# EAGLE schematic optronik (EAGLE 7.5.0)

## Sheet 1 of 4: MAIN
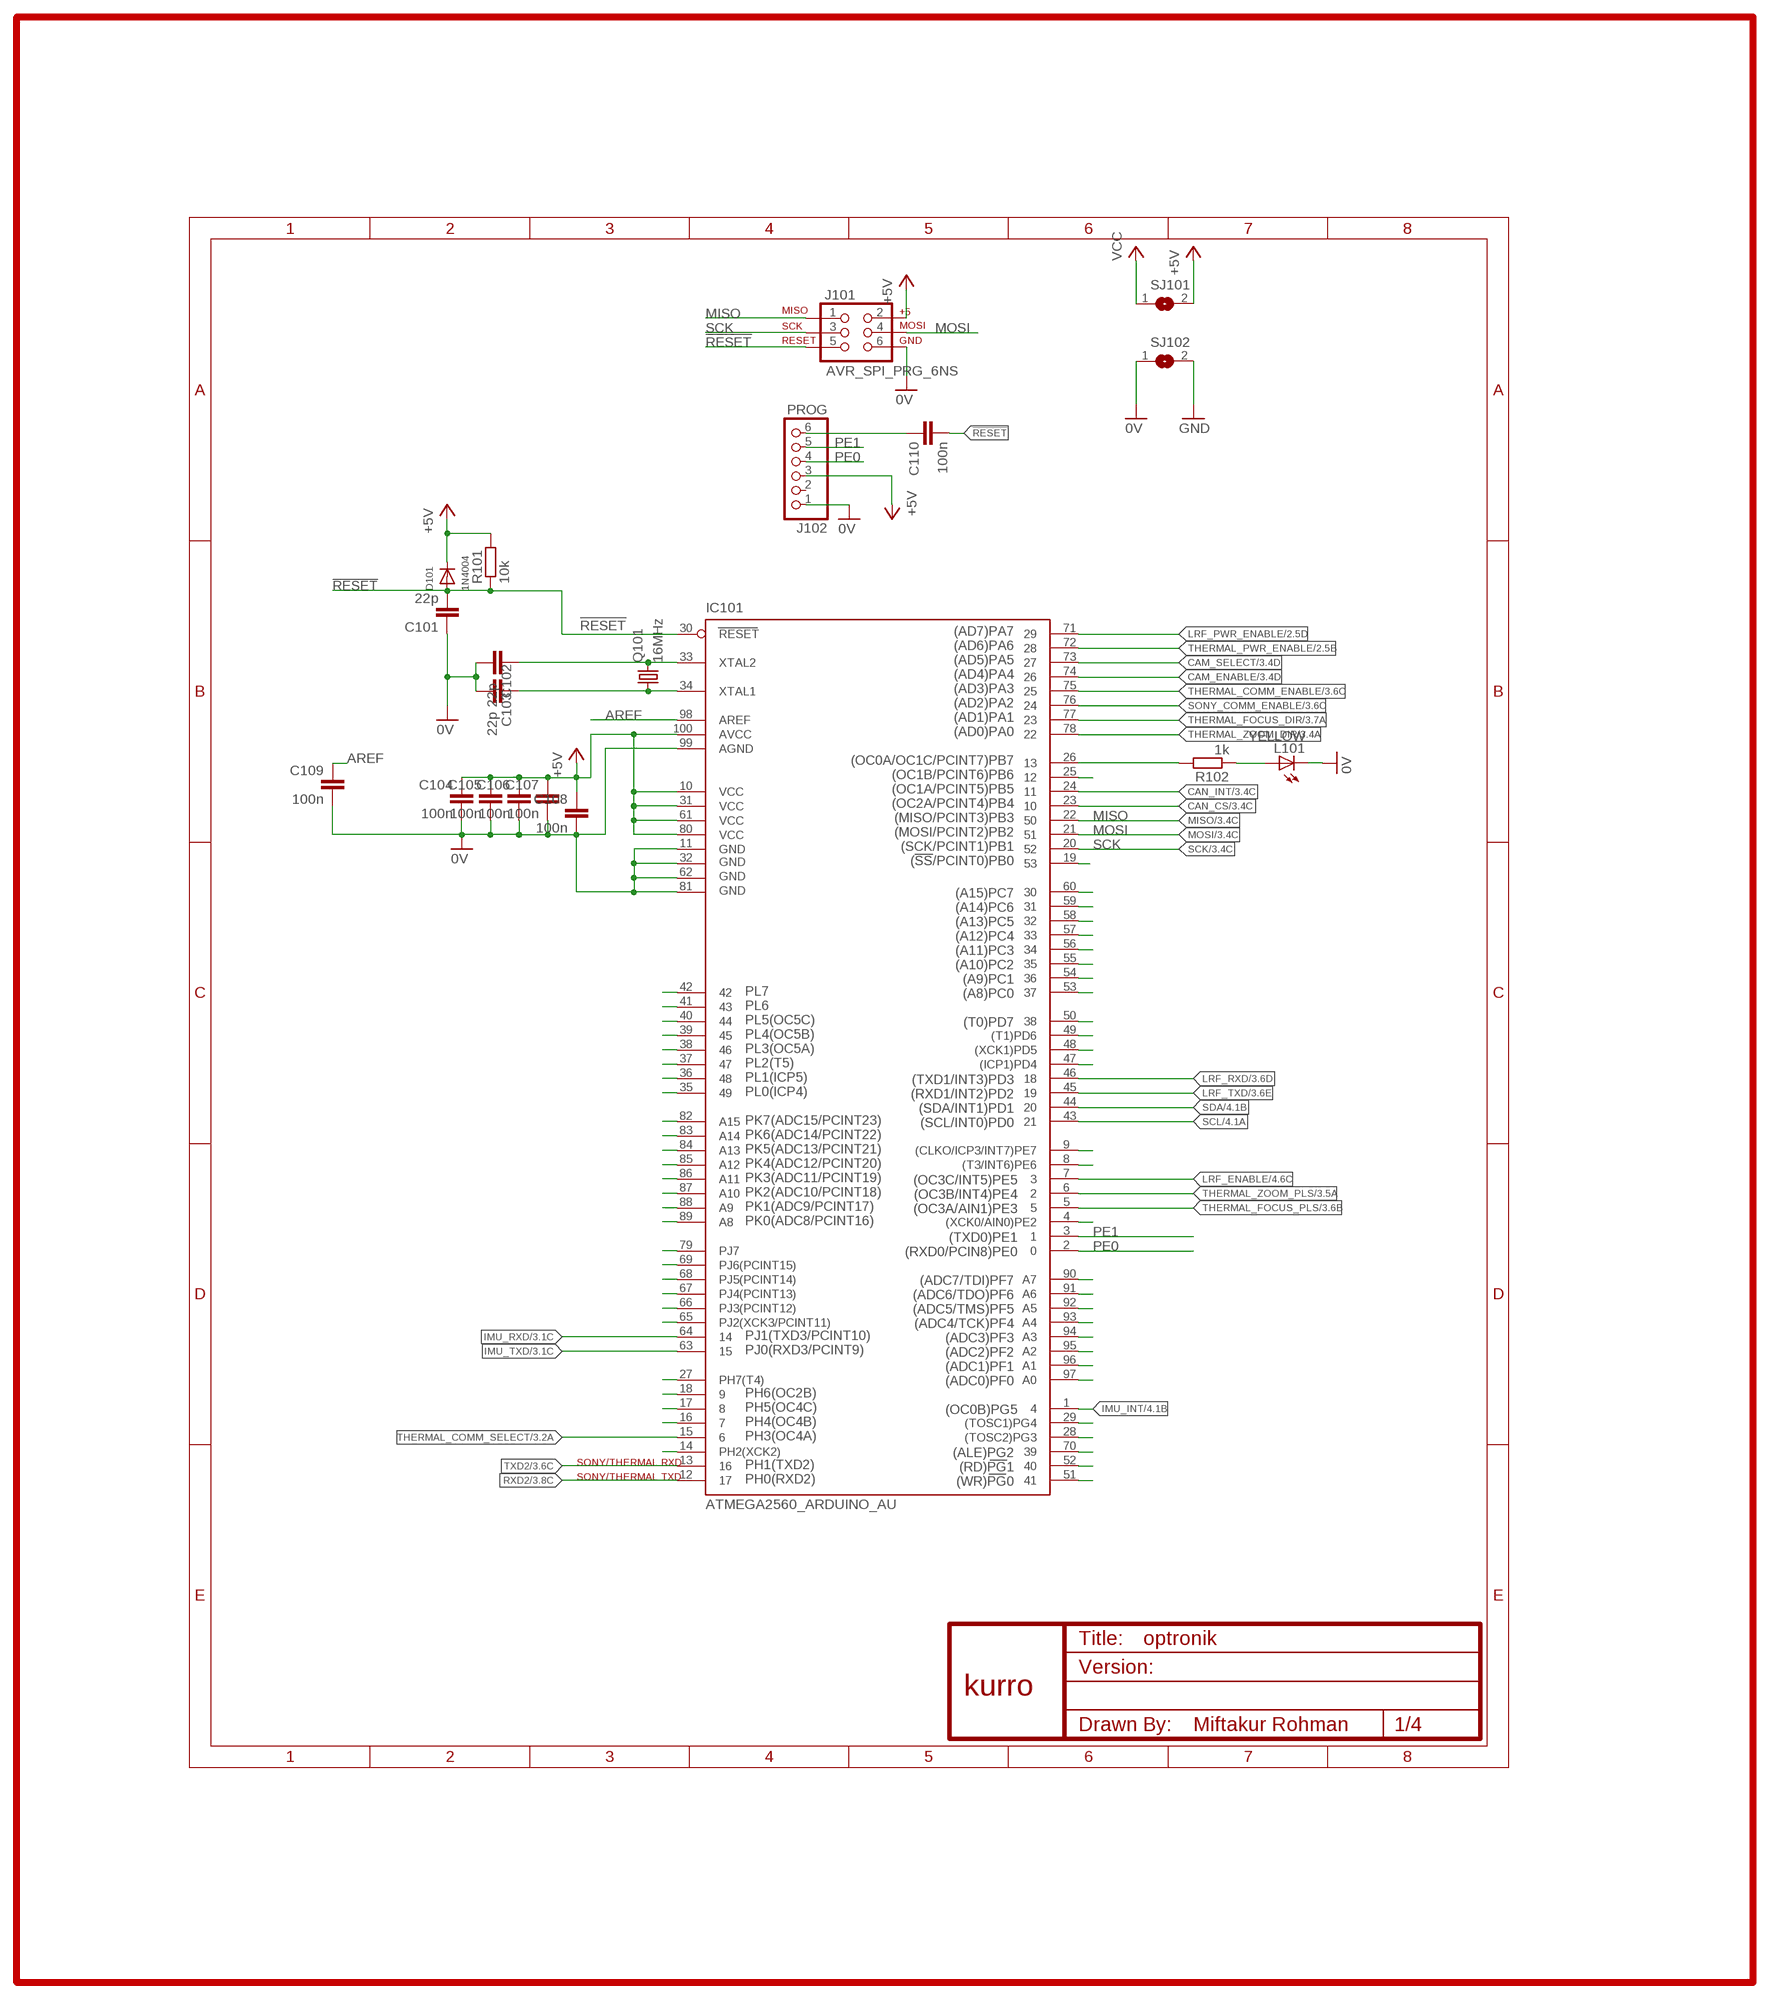
[diagram p0: schematic, sheet 1]

### Parts
C101  22p  C-EUC0603  [C0603]
C102  22p  C-EUC0603  [C0603]
C103  22p  C-EUC0603  [C0603]
C104  100n  C-EUC0603  [C0603]
C105  100n  C-EUC0603  [C0603]
C106  100n  C-EUC0603  [C0603]
C107  100n  C-EUC0603  [C0603]
C108  100n  C-EUC0603  [C0603]
C109  100n  C-EUC0603  [C0603]
C110  100n  C-EUC0603  [C0603]
D101  1N4004  DIODESOD-323F  [SOD-323F]
IC101  ATMEGA2560_ARDUINO_AU  [TQFP-100-14X14MM]
J101  AVR_SPI_PRG_6NS  [2X3-NS]
J102  PROG  PINHD-1X6  [1X06]
L101  YELLOW  LED5MM  [LED5MM]
Q101  16MHz  CRYSTAL-TXC-7A2  [CRYSTAL-TXC-7A2]
R101  10k  R-EU_R0603  [R0603]
R102  1k  R-EU_R0603  [R0603]
SJ101  SJS  [SJS]
SJ102  SJS  [SJS]
U$1  KURRO_FOOTPRINT  [KURRO-LOGO]

### Nets
0V [ic]: C101.1 C102.1 C103.1 C104.2 C105.2 C106.2 C107.2 C108.2 C109.2 IC101.11(GND) IC101.32(GND1) IC101.62(GND2) IC101.81(GND3) IC101.99(AGND) J101.6 J102.1 L101.K(C) SJ102.1
!RESET [ic]: C101.2 C110.2 D101.A IC101.30(RESET) J101.5 R101.1
+5V [ic]: C104.1 C105.1 C106.1 C107.1 C108.1 D101.C IC101.10(VCC) IC101.31(VCC1) IC101.61(VCC2) IC101.80(VCC3) IC101.100(AVCC) J101.2 J102.3 R101.2 SJ101.2
AREF [ic]: C109.1 IC101.98(AREF)
CAM_ENABLE: IC101.74 ; also sheet 3
CAM_SELECT [ic]: IC101.73 ; also sheet 3
CAN_CS: IC101.23 ; also sheet 3
CAN_INT [ic]: IC101.24 ; also sheet 3
GND: SJ102.2 ; also sheet 2,3,4
IMU_INT [ic]: IC101.1 ; also sheet 4
IMU_RXD [ic]: IC101.64 ; also sheet 3
IMU_TXD [ic]: IC101.63 ; also sheet 3
LRF_ENABLE [ic]: IC101.7 ; also sheet 4
LRF_PWR_ENABLE [ic]: IC101.71 ; also sheet 2
LRF_RXD [ic]: IC101.46 ; also sheet 3,4
LRF_TXD [ic]: IC101.45 ; also sheet 3,4
MISO [ic]: IC101.22 J101.1 ; also sheet 3
MOSI [ic]: IC101.21 J101.4 ; also sheet 3
N$1 [ic]: IC101.26 R102.2
N$10 [ic]: IC101.14(PH2(XCK2))
N$13 [ic]: L101.A R102.1
N$15 [ic]: IC101.16
N$17 [ic]: IC101.17
N$18 [ic]: IC101.18
N$19 [ic]: IC101.27(PH7(T4))
N$20 [ic]: IC101.65(PJ2(XCK3/PCINT11))
N$21 [ic]: IC101.66(PJ3(PCINT12))
N$22 [ic]: IC101.67(PJ4(PCINT13))
N$24 [ic]: IC101.68(PJ5(PCINT14))
N$25 [ic]: IC101.69(PJ6(PCINT15))
N$26 [ic]: IC101.79(PJ7)
N$27 [ic]: IC101.89(A8)
N$28 [ic]: IC101.88(A9)
N$29 [ic]: IC101.87(A10)
N$30 [ic]: IC101.86(A11)
N$31 [ic]: IC101.85(A12)
N$32 [ic]: IC101.84(A13)
N$33 [ic]: IC101.83(A14)
N$34 [ic]: IC101.82(A15)
N$35 [ic]: IC101.35
N$36 [ic]: IC101.36
N$37 [ic]: IC101.37
N$38 [ic]: IC101.38
N$39 [ic]: IC101.39
N$40 [ic]: IC101.40
N$41 [ic]: IC101.41
N$42 [ic]: IC101.42
N$49 [ic]: IC101.60
N$50 [ic]: IC101.59
N$51 [ic]: IC101.58
N$52 [ic]: IC101.57
N$53: C110.1 J102.6
N$54 [ic]: IC101.56
N$55 [ic]: IC101.55
N$56 [ic]: IC101.54
N$57 [ic]: IC101.53
N$58 [ic]: IC101.50
N$59 [ic]: IC101.49((T1)PD6)
N$60 [ic]: IC101.48((XCK1)PD5)
N$61 [ic]: IC101.47((ICP1)PD4)
N$63 [ic]: IC101.25
N$64 [ic]: IC101.9((CLKO/ICP3/INT7)PE7)
N$65 [ic]: IC101.8((T3/INT6)PE6)
N$66 [ic]: IC101.4((XCK0/AIN0)PE2)
N$67 [ic]: IC101.90(A7)
N$68 [ic]: IC101.91(A6)
N$69 [ic]: IC101.92(A5)
N$70 [ic]: IC101.93(A4)
N$71 [ic]: IC101.94(A3)
N$72 [ic]: IC101.95(A2)
N$73 [ic]: IC101.96(A1)
N$74 [ic]: IC101.97(A0)
N$76 [ic]: IC101.29((TOSC1)PG4)
N$77 [ic]: IC101.28((TOSC2)PG3)
N$78 [ic]: IC101.70
N$79 [ic]: IC101.52
N$80 [ic]: IC101.51
N$84 [ic]: IC101.19
PE0 [ic]: IC101.2 J102.4
PE1 [ic]: IC101.3 J102.5
RXD2 [ic]: IC101.12 ; also sheet 3
SCK [ic]: IC101.20 J101.3 ; also sheet 3
SCL [ic]: IC101.43 ; also sheet 4
SDA [ic]: IC101.44 ; also sheet 4
SONY_COMM_ENABLE [ic]: IC101.76 ; also sheet 3
THERMAL_COMM_ENABLE [ic]: IC101.75 ; also sheet 3
THERMAL_COMM_SELECT [ic]: IC101.15 ; also sheet 3
THERMAL_FOCUS_DIR [ic]: IC101.77 ; also sheet 3
THERMAL_FOCUS_PLS [ic]: IC101.5 ; also sheet 3
THERMAL_PWR_ENABLE [ic]: IC101.72 ; also sheet 2
THERMAL_ZOOM_DIR [ic]: IC101.78 ; also sheet 3
THERMAL_ZOOM_PLS [ic]: IC101.6 ; also sheet 3
TXD2 [ic]: IC101.13 ; also sheet 3
VCC: SJ101.1 ; also sheet 2,3,4
XTAL1 [ic]: C103.2 IC101.34(XTAL1) Q101.P$1
XTAL2 [ic]: C102.2 IC101.33(XTAL2) Q101.P$2
Unconnected: J102.2

### Notes on the sheet
- SONY/THERMAL RXD
- SONY/THERMAL TXD

## Sheet 2 of 4: PSU
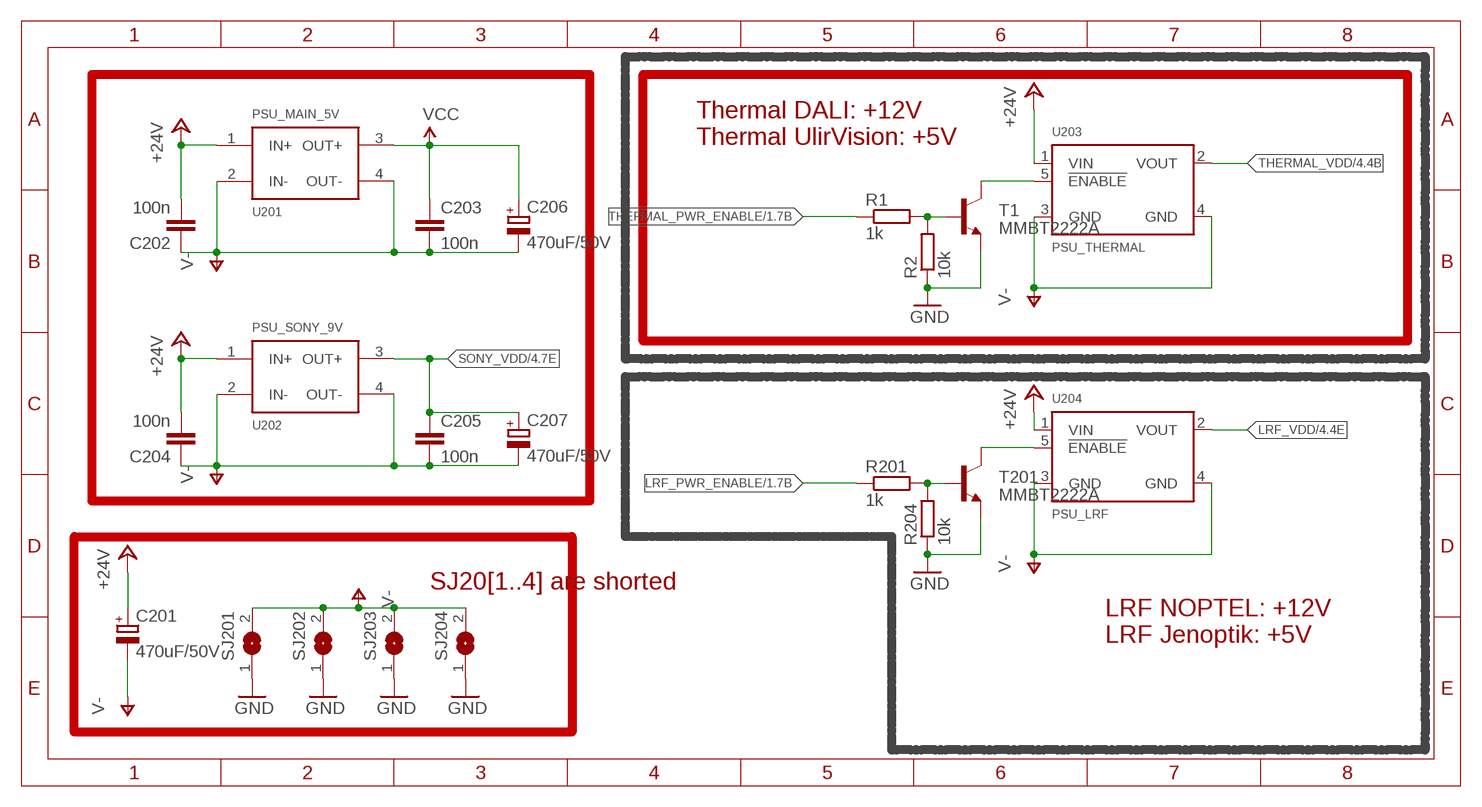
[diagram p1: schematic, sheet 2]

### Parts
C201  470uF/50V  CPOL-EUE3.5-10  [E3,5-10]
C202  100n  C-EUC0603  [C0603]
C203  100n  C-EUC0603  [C0603]
C204  100n  C-EUC0603  [C0603]
C205  100n  C-EUC0603  [C0603]
C206  470uF/50V  CPOL-EUE3.5-10  [E3,5-10]
C207  470uF/50V  CPOL-EUE3.5-10  [E3,5-10]
R1  1k  R-EU_R0603  [R0603]
R2  10k  R-EU_R0603  [R0603]
R201  1k  R-EU_R0603  [R0603]
R204  10k  R-EU_R0603  [R0603]
SJ201  SJS  [SJS]
SJ202  SJS  [SJS]
SJ203  SJS  [SJS]
SJ204  SJS  [SJS]
T1  MMBT2222A  TRANSISTOR_NPNSOT23  [SOT23]
T201  MMBT2222A  TRANSISTOR_NPNSOT23  [SOT23]
U201  PSU_MAIN_5V  MP1584_MIN  [MP1584_MIN]
U202  PSU_SONY_9V  MP1584_MIN  [MP1584_MIN]
U203  PSU_THERMAL  MOD_LM2596  [MOD_LM2596]
U204  PSU_LRF  MOD_LM2596  [MOD_LM2596]

### Nets
+24V [power]: C201.+ C202.2 C204.2 U201.1(IN+) U202.1(IN+) U203.1(VIN) U204.1(VIN) ; also sheet 4
GND: R2.1 R204.1 SJ201.1 SJ202.1 SJ203.1 SJ204.1 T1.2(E) T201.2(E) ; also sheet 1,3,4
LRF_PWR_ENABLE [ic]: R201.1 ; also sheet 1
LRF_VDD: U204.2(VOUT) ; also sheet 4
N$82: R1.2 R2.2 T1.1(B)
N$83: T1.3(C) U203.5(!ENABLE)
N$97: R201.2 R204.2 T201.1(B)
N$100: T201.3(C) U204.5(!ENABLE)
SONY_VDD: C205.1 C207.+ U202.3(OUT+) ; also sheet 4
THERMAL_PWR_ENABLE [ic]: R1.1 ; also sheet 1
THERMAL_VDD: U203.2(VOUT) ; also sheet 4
V- [power]: C201.- C202.1 C203.2 C204.1 C205.2 C206.- C207.- SJ201.2 SJ202.2 SJ203.2 SJ204.2 U201.2(IN-) U201.4(OUT-) U202.2(IN-) U202.4(OUT-) U203.3(GND) U203.4(GND) U204.3(GND) U204.4(GND) ; also sheet 4
VCC: C203.1 C206.+ U201.3(OUT+) ; also sheet 1,3,4

### Notes on the sheet
- Thermal DALI: +12V
  Thermal UlirVision: +5V
- SJ20[1..4] are shorted
- LRF NOPTEL: +12V
  LRF Jenoptik: +5V

## Sheet 3 of 4: COMM & VIDEO
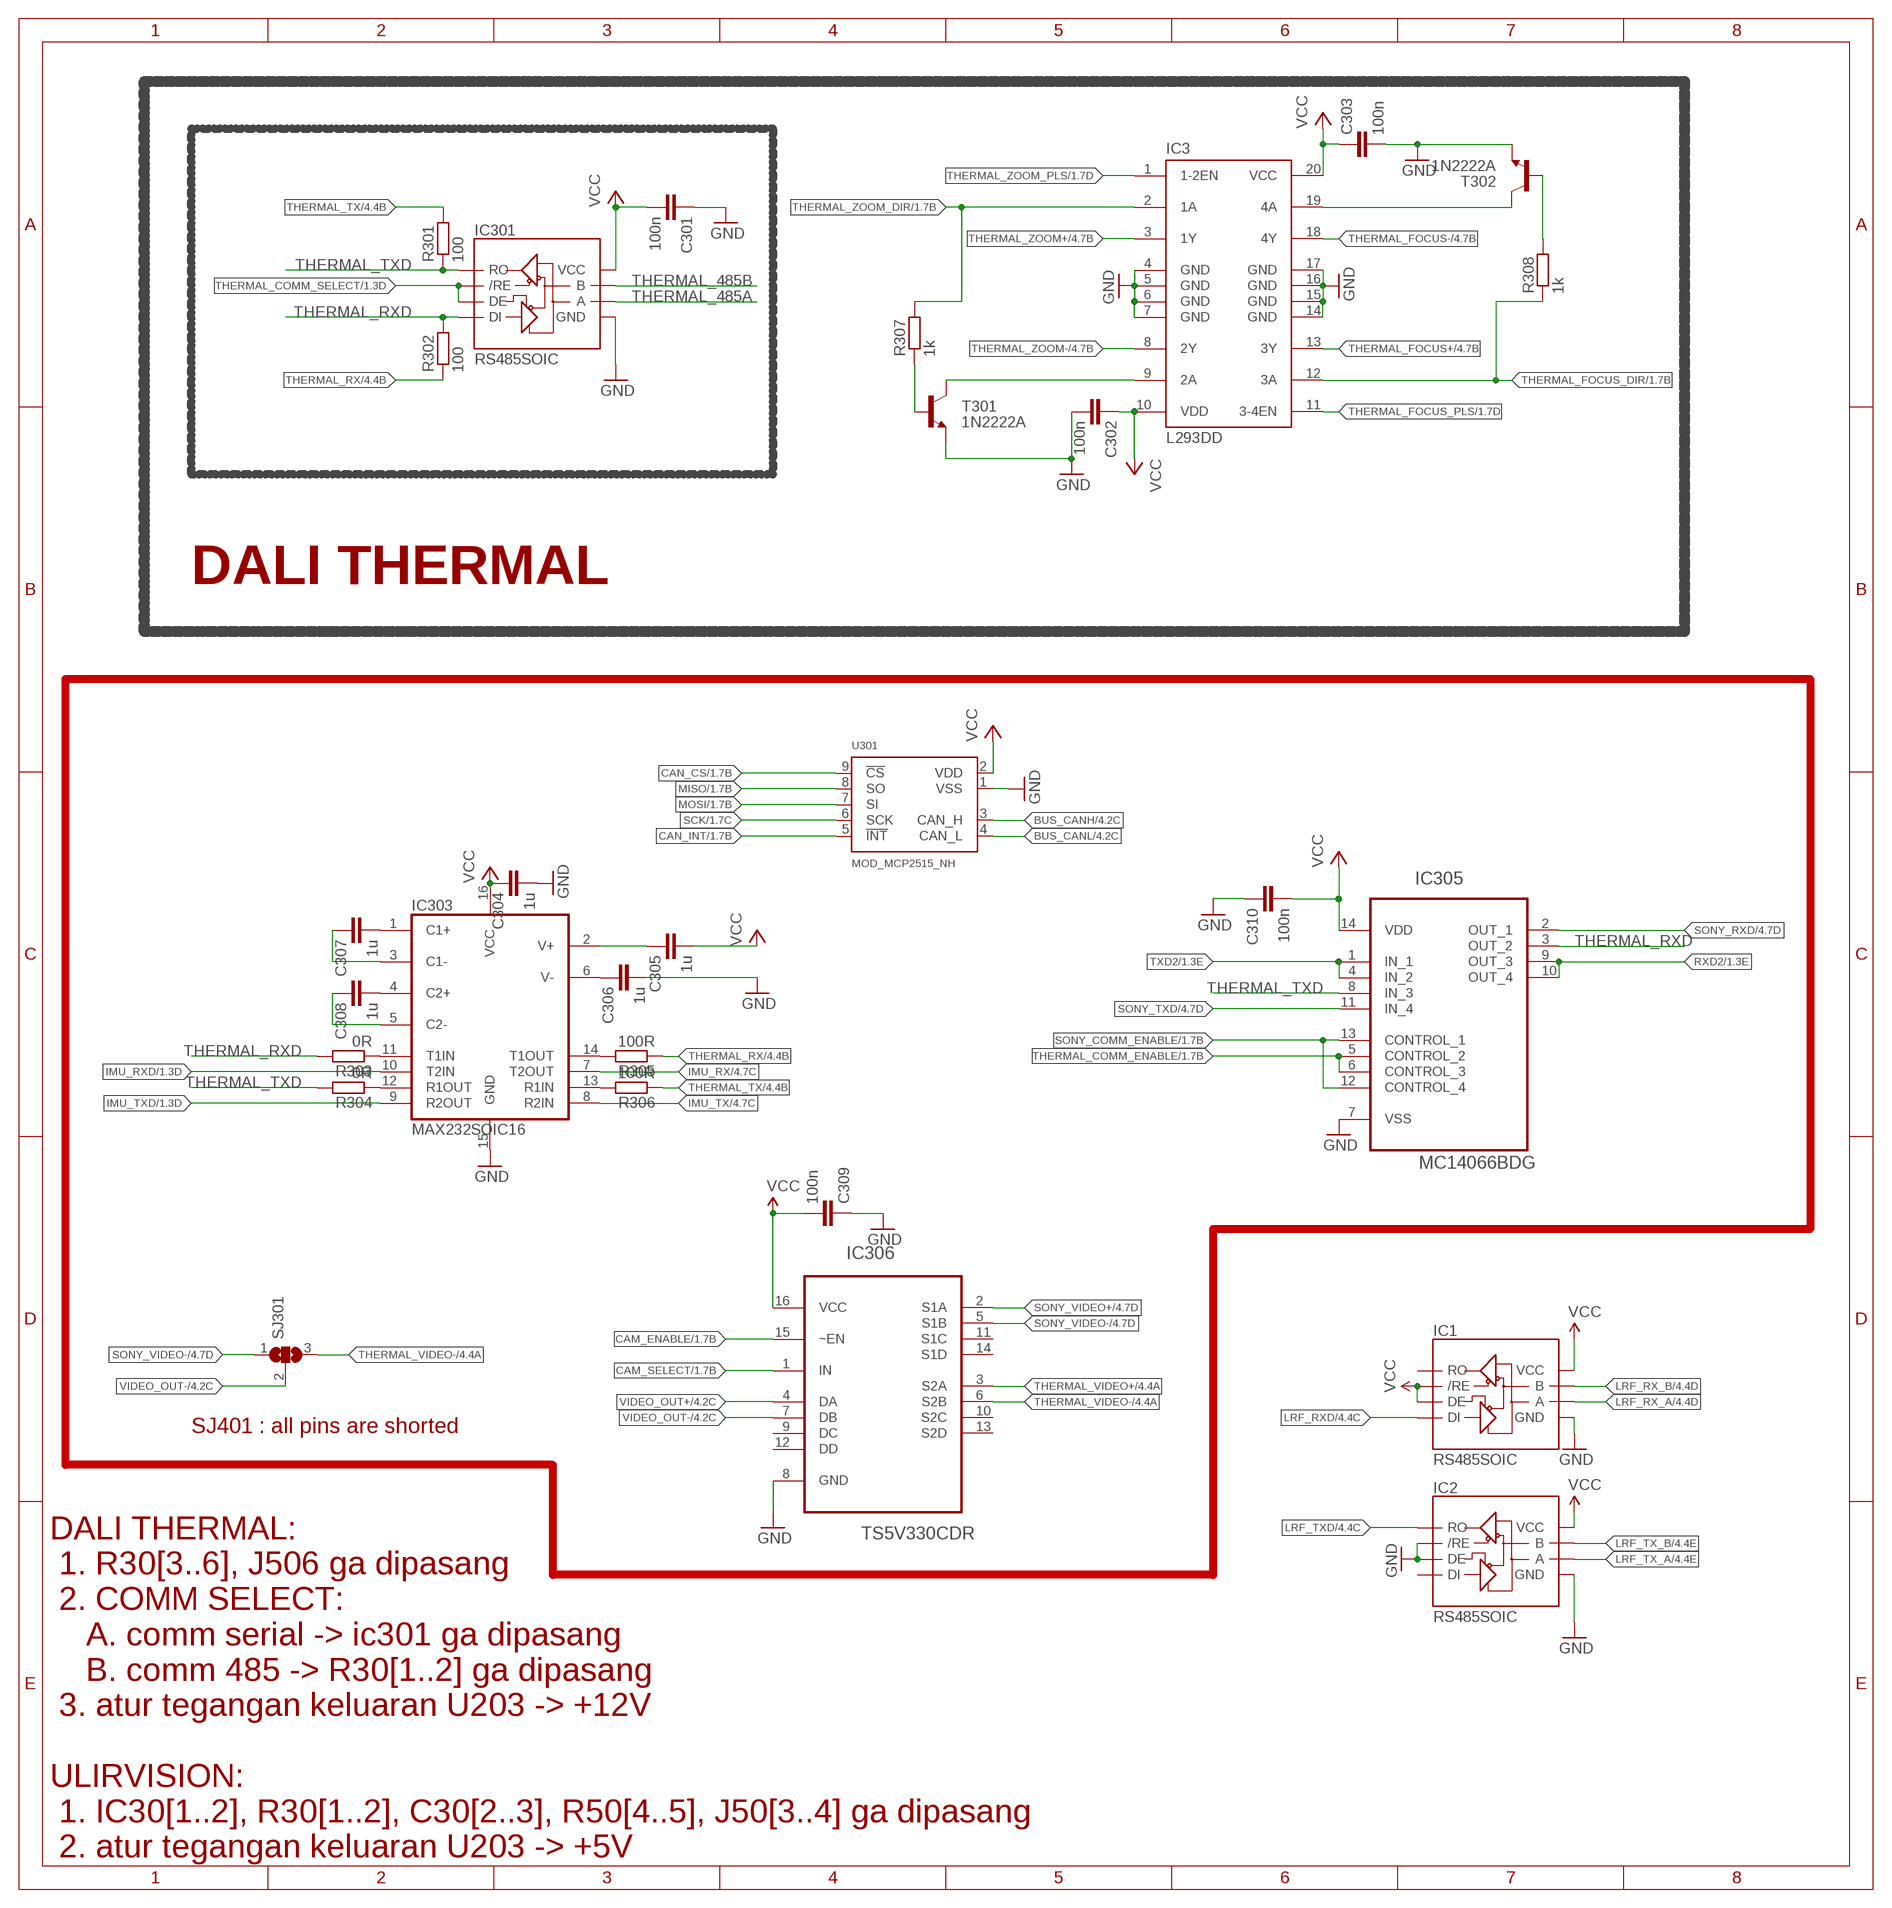
[diagram p2: schematic, sheet 3]

### Parts
C301  100n  C-EUC0603  [C0603]
C302  100n  C-EUC0603  [C0603]
C303  100n  C-EUC0603  [C0603]
C304  1u  C-EUC0603  [C0603]
C305  1u  C-EUC0603  [C0603]
C306  1u  C-EUC0603  [C0603]
C307  1u  C-EUC0603  [C0603]
C308  1u  C-EUC0603  [C0603]
C309  100n  C-EUC0603  [C0603]
C310  100n  C-EUC0603  [C0603]
IC1  RS485SOIC  [SO08]
IC2  RS485SOIC  [SO08]
IC3  L293DD  [SO20W]
IC301  RS485SOIC  [SO08]
IC303  MAX232SOIC16  [SO016]
IC305  MC14066BDG  [SOIC127P600X175-14N]
IC306  TS5V330CDR  [SOIC127P600X175-16N]
R301  100  R-EU_R0603  [R0603]
R302  100  R-EU_R0603  [R0603]
R303  0R  R-EU_R0603  [R0603]
R304  0R  R-EU_R0603  [R0603]
R305  100R  R-EU_R0603  [R0603]
R306  100R  R-EU_R0603  [R0603]
R307  1k  R-EU_R0603  [R0603]
R308  1k  R-EU_R0603  [R0603]
SJ301  SJ2WS  [SJ_2S]
T301  1N2222A  TRANSISTOR_NPNSOT23  [SOT23]
T302  1N2222A  TRANSISTOR_NPNSOT23  [SOT23]
U301  MOD_MCP2515_NH  [MCP2515_CAN2]

### Nets
BUS_CANH: U301.3(CAN_H) ; also sheet 4
BUS_CANL: U301.4(CAN_L) ; also sheet 4
CAM_ENABLE: IC306.15(~EN) ; also sheet 1
CAM_SELECT [ic]: IC306.1(IN) ; also sheet 1
CAN_CS: U301.9(!CS) ; also sheet 1
CAN_INT [ic]: U301.5(!INT) ; also sheet 1
GND: C301.1 C302.2 C303.2 C304.2 C306.2 C309.1 C310.1 IC1.5(GND) IC2.2(/RE) IC2.3(DE) IC2.5(GND) IC3.4(GND) IC3.5(GND) IC3.6(GND) IC3.7(GND) IC3.14(GND) IC3.15(GND) IC3.16(GND) IC3.17(GND) IC301.5(GND) IC303.15(GND) IC305.7(VSS) IC306.8(GND) T301.2(E) T302.2(E) U301.1(VSS) ; also sheet 1,2,4
IMU_RX: IC303.7(T2OUT) ; also sheet 4
IMU_RXD [ic]: IC303.10(T2IN) ; also sheet 1
IMU_TX: IC303.8(R2IN) ; also sheet 4
IMU_TXD [ic]: IC303.9(R2OUT) ; also sheet 1
LRF_RX_A: IC1.6(A) ; also sheet 4
LRF_RX_B: IC1.7(B) ; also sheet 4
LRF_RXD [ic]: IC1.4(DI) ; also sheet 1,4
LRF_TX_A: IC2.6(A) ; also sheet 4
LRF_TX_B: IC2.7(B) ; also sheet 4
LRF_TXD [ic]: IC2.1(RO) ; also sheet 1,4
MISO [ic]: U301.8(SO) ; also sheet 1
MOSI [ic]: U301.7(SI) ; also sheet 1
N$2: C307.1 IC303.3(C1-)
N$5: IC303.14(T1OUT) R305.2
N$6: IC303.13(R1IN) R306.2
N$7: IC303.11(T1IN) R303.1
N$8: C306.1 IC303.6(V-)
N$9: IC303.12(R1OUT) R304.1
N$11: C307.2 IC303.1(C1+)
N$14: C308.1 IC303.5(C2-)
N$16: C308.2 IC303.4(C2+)
N$23: C305.1 IC303.2(V+)
N$89: R307.1 T301.1(B)
N$90: IC3.9(2A) T301.3(C)
N$91: IC3.19(4A) T302.3(C)
N$92: R308.2 T302.1(B)
RXD2 [ic]: IC305.9(OUT_3) IC305.10(OUT_4) ; also sheet 1
SCK [ic]: U301.6(SCK) ; also sheet 1
SONY_COMM_ENABLE [ic]: IC305.12(CONTROL_4) IC305.13(CONTROL_1) ; also sheet 1
SONY_RXD: IC305.2(OUT_1) ; also sheet 4
SONY_TXD: IC305.11(IN_4) ; also sheet 4
SONY_VIDEO+: IC306.2(S1A) ; also sheet 4
SONY_VIDEO-: IC306.5(S1B) SJ301.1 ; also sheet 4
THERMAL_485A: IC301.6(A) ; also sheet 4
THERMAL_485B: IC301.7(B) ; also sheet 4
THERMAL_COMM_ENABLE [ic]: IC305.5(CONTROL_2) IC305.6(CONTROL_3) ; also sheet 1
THERMAL_COMM_SELECT [ic]: IC301.2(/RE) IC301.3(DE) ; also sheet 1
THERMAL_FOCUS+: IC3.13(3Y) ; also sheet 4
THERMAL_FOCUS-: IC3.18(4Y) ; also sheet 4
THERMAL_FOCUS_DIR [ic]: IC3.12(3A) R308.1 ; also sheet 1
THERMAL_FOCUS_PLS [ic]: IC3.11(3-4EN) ; also sheet 1
THERMAL_RX: R302.1 R305.1 ; also sheet 4
THERMAL_RXD: IC301.4(DI) IC305.3(OUT_2) R302.2 R303.2
THERMAL_TX: R301.2 R306.1 ; also sheet 4
THERMAL_TXD: IC301.1(RO) IC305.8(IN_3) R301.1 R304.2
THERMAL_VIDEO+: IC306.3(S2A) ; also sheet 4
THERMAL_VIDEO-: IC306.6(S2B) SJ301.3 ; also sheet 4
THERMAL_ZOOM+: IC3.3(1Y) ; also sheet 4
THERMAL_ZOOM-: IC3.8(2Y) ; also sheet 4
THERMAL_ZOOM_DIR [ic]: IC3.2(1A) R307.2 ; also sheet 1
THERMAL_ZOOM_PLS [ic]: IC3.1(1-2EN) ; also sheet 1
TXD2 [ic]: IC305.1(IN_1) IC305.4(IN_2) ; also sheet 1
VCC: C301.2 C302.1 C303.1 C304.1 C305.2 C309.2 C310.2 IC1.2(/RE) IC1.3(DE) IC1.8(VCC) IC2.8(VCC) IC3.10(VDD) IC3.20(VCC) IC301.8(VCC) IC303.16(VCC) IC305.14(VDD) IC306.16(VCC) U301.2(VDD) ; also sheet 1,2,4
VIDEO_OUT+: IC306.4(DA) ; also sheet 4
VIDEO_OUT-: IC306.7(DB) SJ301.2 ; also sheet 4
Unconnected: IC1.1(RO) IC2.4(DI) IC306.9(DC) IC306.10(S2C) IC306.11(S1C) IC306.12(DD) IC306.13(S2D) IC306.14(S1D)

### Notes on the sheet
- DALI THERMAL
- SJ401 : all pins are shorted
- DALI THERMAL:
   1. R30[3..6], J506 ga dipasang
   2. COMM SELECT:
      A. comm serial -> ic301 ga dipasang
      B. comm 485 -> R30[1..2] ga dipasang
   3. atur tegangan keluaran U203 -> +12V
  
  ULIRVISION:
   1. IC30[1..2], R30[1..2], C30[2..3], R50[4..5], J50[3..4] ga dipasang
   2. atur tegangan keluaran U203 -> +5V

## Sheet 4 of 4: CONNECTOR
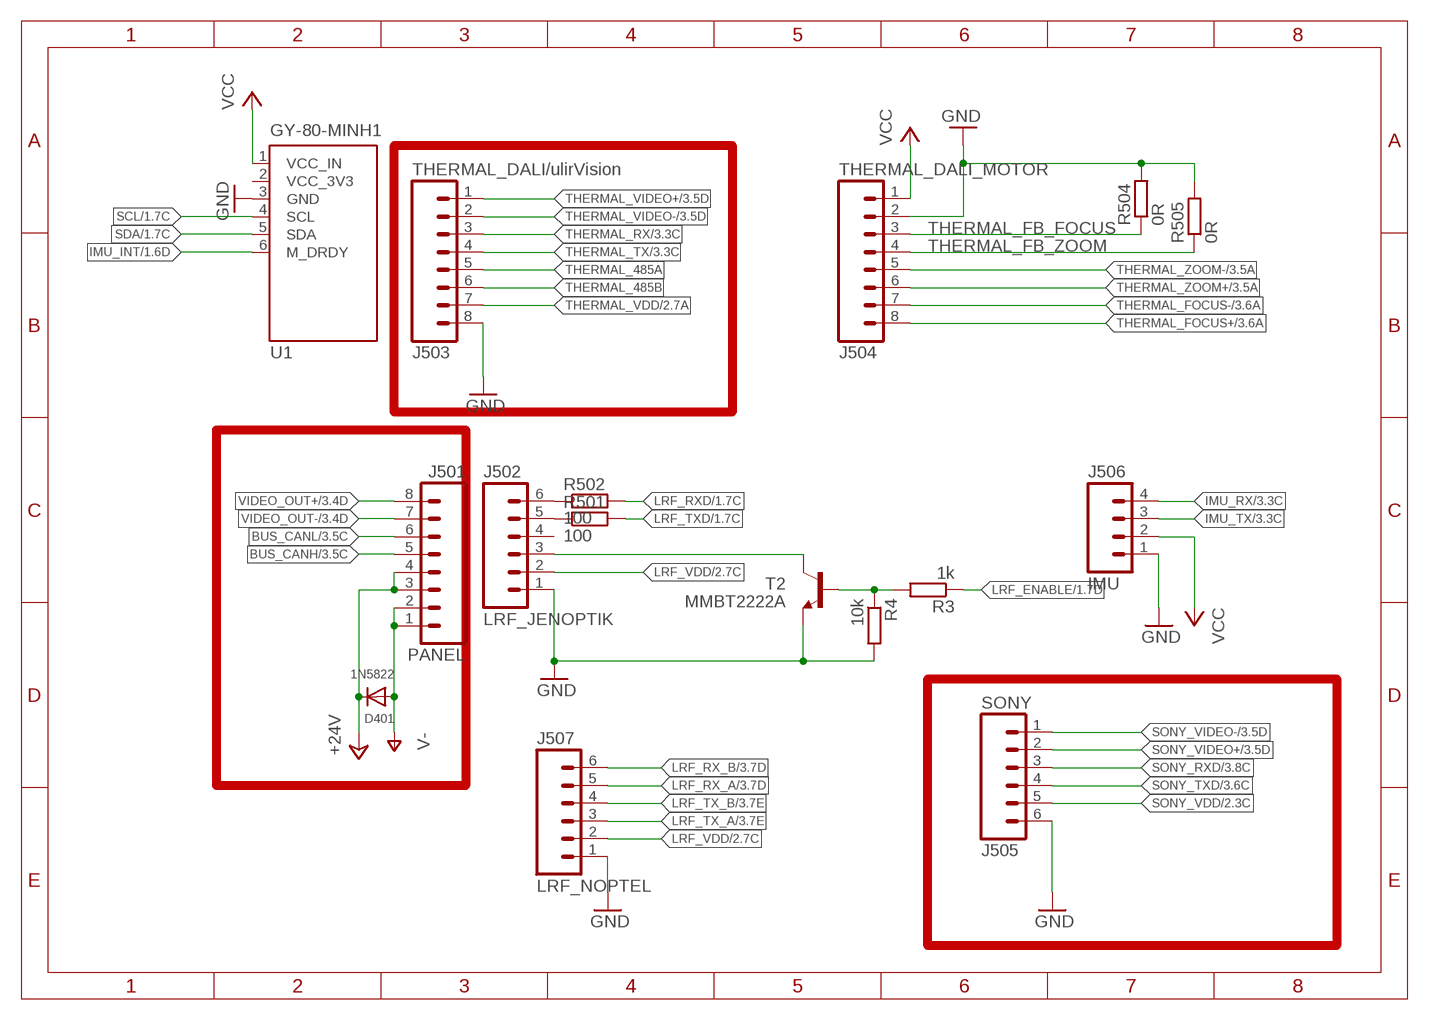
[diagram p3: schematic, sheet 4]

### Parts
D401  1N5822  DIODESMA  [SMADIODE]
J501  PANEL  M08-XH-RA  [XH-8-RA]
J502  LRF_JENOPTIK  M06-XH-RA  [XH-6-RA]
J503  THERMAL_DALI/ulirVision  M08-XH-RA  [XH-8-RA]
J504  THERMAL_DALI_MOTOR  M08-XH-RA  [XH-8-RA]
J505  SONY  M06-XH-RA  [XH-6-RA]
J506  IMU  M04-XH-RA  [XH-4-RA]
J507  LRF_NOPTEL  M06-XH-RA  [XH-6-RA]
R3  1k  R-EU_R0603  [R0603]
R4  10k  R-EU_R0603  [R0603]
R501  100  R-EU_R0603  [R0603]
R502  100  R-EU_R0603  [R0603]
R504  0R  R-EU_R0603  [R0603]
R505  0R  R-EU_R0603  [R0603]
T2  MMBT2222A  TRANSISTOR_NPNSOT23  [SOT23]
U1  GY-80-MINH1  [GY-80-MINH1]

### Nets
+24V [power]: D401.C J501.3 J501.4 ; also sheet 2
BUS_CANH: J501.5 ; also sheet 3
BUS_CANL: J501.6 ; also sheet 3
GND: J502.1 J503.8 J504.2 J505.6 J506.1 J507.1 R4.2 R504.2 R505.2 T2.2(E) U1.3(GND) ; also sheet 1,2,3
IMU_INT [ic]: U1.6(M_DRDY) ; also sheet 1
IMU_RX: J506.4 ; also sheet 3
IMU_TX: J506.3 ; also sheet 3
LRF_ENABLE [ic]: R3.1 ; also sheet 1
LRF_RX_A: J507.5 ; also sheet 3
LRF_RX_B: J507.6 ; also sheet 3
LRF_RXD [ic]: R502.2 ; also sheet 1,3
LRF_TX_A: J507.3 ; also sheet 3
LRF_TX_B: J507.4 ; also sheet 3
LRF_TXD [ic]: R501.2 ; also sheet 1,3
LRF_VDD: J502.2 J507.2 ; also sheet 2
N$3: J502.5 R501.1
N$4: J502.6 R502.1
N$12: J502.3 T2.3(C)
N$81: R3.2 R4.1 T2.1(B)
SCL [ic]: U1.4(SCL) ; also sheet 1
SDA [ic]: U1.5(SDA) ; also sheet 1
SONY_RXD: J505.3 ; also sheet 3
SONY_TXD: J505.4 ; also sheet 3
SONY_VDD: J505.5 ; also sheet 2
SONY_VIDEO+: J505.2 ; also sheet 3
SONY_VIDEO-: J505.1 ; also sheet 3
THERMAL_485A: J503.5 ; also sheet 3
THERMAL_485B: J503.6 ; also sheet 3
THERMAL_FB_FOCUS: J504.3 R504.1
THERMAL_FB_ZOOM: J504.4 R505.1
THERMAL_FOCUS+: J504.8 ; also sheet 3
THERMAL_FOCUS-: J504.7 ; also sheet 3
THERMAL_RX: J503.3 ; also sheet 3
THERMAL_TX: J503.4 ; also sheet 3
THERMAL_VDD: J503.7 ; also sheet 2
THERMAL_VIDEO+: J503.1 ; also sheet 3
THERMAL_VIDEO-: J503.2 ; also sheet 3
THERMAL_ZOOM+: J504.6 ; also sheet 3
THERMAL_ZOOM-: J504.5 ; also sheet 3
V- [power]: D401.A J501.1 J501.2 ; also sheet 2
VCC: J504.1 J506.2 U1.1(VCC_IN) ; also sheet 1,2,3
VIDEO_OUT+: J501.8 ; also sheet 3
VIDEO_OUT-: J501.7 ; also sheet 3
Unconnected: J502.4 U1.2(VCC_3V3)

## Library data of the parts
C101-C110 C202-C205 = rcl:C-EU: CAPACITOR, European symbol
C201 C206 C207 = resistor:CPOL-EU: POLARIZED CAPACITOR, European symbol
C301-C310 = resistor:C-EU: CAPACITOR, European symbol
D101 D401 = adafruit:DIODE: Diode SMADIODE - SMA Surface Mount Package 20V 1A Schottky Diode Digikey: 641-1014-6-ND DO-1N4148 - Through Hole Small Current Diode SOD-123 20V 1 A (.5mV Vf) Schottky Diode - Digikey: MBRX120TPMSCT-ND SOD-323 10V 570mA (.38mV Vf, 3ns) Schottky Diode - Digikey: ZLLS410CT-ND SOD-523 30V 30mA Schottky Diode (RB751S-40TE61) - Digikey: RB751S-40TE61CT-ND SOT23-R/W - SOT23 Package (R = Solder Paste/Reflow Ovens, W = Hand-Soldering) BAT54Film 40V 300mA - Digikey: 497-7162-1-ND
IC1 IC2 IC301 = SparkFun-DigitalIC:RS485: RS485 transceiver
IC3 = adafruit:L293DD
IC101 = SparkFun-DigitalIC:ATMEGA2560_ARDUINO
IC303 = SparkFun-DigitalIC:MAX232: RS232 Transceiver Very common IC. This is generically called 'MAX232', but works with the 3V equivalent MAX3232 generic ICs. Field tested and mother approved. Spark Fun Electronics SKU : COM-00316 (DIP) and COM-00589 (SMD); PROD_ID: IC-08171
IC305 = ON Semiconductor_By_element14_Batch_1:MC14066BDG: Quad Analog Switch/Quad Multiplexer; MPN: MC14066BDG; OC_FARNELL: 9666443; OC_NEWARK: 45J1068; PACKAGE: SOIC-14; SUPPLIER: ON SEMICONDUCTOR
IC306 = Texas Instruments_By_element14_Batch_1:TS5V330CDR: QUAD SPDT WIDE BANDWIDTH VIDEO SWITCH WITH LOW ON-STATE RESISTANCE; MPN: TS5V330CDR; OC_FARNELL: -; OC_NEWARK: 09R6745; PACKAGE: SOIC-16; SUPPLIER: Texas Instruments
J101 = SparkFun-Connectors:AVR_SPI_PRG_6: AVR ISP 6 Pin This is the reduced ISP connector for AVR programming. Common on Arduino. This footprint will take up less PCB space and can be used with a 10-pin to 6-pin adapter such as SKU: BOB-08508
J102 = adafruit:PINHD-1X6: PIN HEADER
J501 J503 J504 = SparkFun-Connectors:M08: Header 8 Standard 8-pin 0.1" header. Use with straight break away headers (SKU : PRT-00116), right angle break away headers (PRT-00553), swiss pins (PRT-00743), machine pins (PRT-00117), and female headers (PRT-00115).
J502 J505 J507 = SparkFun-Connectors:M06: Header 6 Standard 6-pin 0.1" header. Use with straight break away headers (SKU : PRT-00116), right angle break away headers (PRT-00553), swiss pins (PRT-00743), machine pins (PRT-00117), and female headers (PRT-00115). Molex polarized connector foot print use with SKU : PRT-08094 with associated crimp pins and housings. NOTES ON THE VARIANTS LOCK and LOCK_LONGPADS... This footprint was designed to help hold the alignment of a through-hole component (i.e. 6-pin header) while soldering it into place. You may notice that each hole has been shifted either up or down by 0.005 of an inch from it's more standard position (which is a perfectly straight line). This slight alteration caused the pins (the squares in the middle) to touch the edges of the holes. Because they are alternating, it causes a "brace" to hold the component in place. 0.005 has proven to be the perfect amount of "off-center" position when using our standard breakaway headers. Although looks a little odd when you look at the bare footprint, once you have a header in there, the alteration is very hard to notice. Also,if you push a header all the way into place, it is covered up entirely on the bottom side. This idea of altering the position of holes to aid alignment will be further integrated into the Sparkfun Library for other footprints. It can help hold any component with 3 or more connection pins.
J506 = SparkFun-Connectors:M04: Header 4 Standard 4-pin 0.1" header. Use with straight break away headers (SKU : PRT-00116), right angle break away headers (PRT-00553), swiss pins (PRT-00743), machine pins (PRT-00117), and female headers (PRT-00115). Molex polarized connector foot print use with SKU : PRT-08231 with associated crimp pins and housings. 1MM SMD Version SKU: PRT-10208
L101 = led:LED: LED OSRAM: - CHIPLED LG R971, LG N971, LY N971, LG Q971, LY Q971, LO R971, LY R971 LH N974, LH R974 LS Q976, LO Q976, LY Q976 LO Q996 - Hyper CHIPLED LW Q18S LB Q993, LB Q99A, LB R99A - SideLED LS A670, LO A670, LY A670, LG A670, LP A670 LB A673, LV A673, LT A673, LW A673 LH A674 LY A675 LS A676, LA A676, LO A676, LY A676, LW A676 LS A679, LY A679, LG A679 - Hyper Micro SIDELED® LS Y876, LA Y876, LO Y876, LY Y876 LT Y87S - SmartLED LW L88C, LW L88S LB L89C, LB L89S, LG L890 LS L89K, LO L89K, LY L89K LS L896, LA L896, LO L896, LY L896 - TOPLED LS T670, LO T670, LY T670, LG T670, LP T670 LSG T670, LSP T670, LSY T670, LOP T670, LYG T670 LG T671, LOG T671, LSG T671 LB T673, LV T673, LT T673, LW T673 LH T674 LS T676, LA T676, LO T676, LY T676, LB T676, LH T676, LSB T676, LW T676 LB T67C, LV T67C, LT T67C, LS T67K, LO T67K, LY T67K, LW E67C LS E67B, LA E67B, LO E67B, LY E67B, LB E67C, LV E67C, LT E67C LW T67C LS T679, LY T679, LG T679 LS T770, LO T770, LY T770, LG T770, LP T770 LB T773, LV T773, LT T773, LW T773 LH T774 LS E675, LA E675, LY E675, LS T675 LS T776, LA T776, LO T776, LY T776, LB T776 LHGB T686 LT T68C, LB T68C - Hyper Mini TOPLED® LB M676 - Mini TOPLED Santana® LG M470 LS M47K, LO M47K, LY M47K Source: http://www.osram.convergy.de LUXEON: - LUMILED® LXK2-PW12-R00, LXK2-PW12-S00, LXK2-PW14-U00, LXK2-PW14-V00 LXK2-PM12-R00, LXK2-PM12-S00, LXK2-PM14-U00 LXK2-PE12-Q00, LXK2-PE12-R00, LXK2-PE12-S00, LXK2-PE14-T00, LXK2-PE14-U00 LXK2-PB12-K00, LXK2-PB12-L00, LXK2-PB12-M00, LXK2-PB14-N00, LXK2-PB14-P00, LXK2-PB14-Q00 LXK2-PR12-L00, LXK2-PR12-M00, LXK2-PR14-Q00, LXK2-PR14-R00 LXK2-PD12-Q00, LXK2-PD12-R00, LXK2-PD12-S00 LXK2-PH12-R00, LXK2-PH12-S00 LXK2-PL12-P00, LXK2-PL12-Q00, LXK2-PL12-R00 Source: www.luxeon.com KINGBRIGHT: KA-3528ASYC Source: www.kingbright.com
Q101 = SparkFun-FreqCtrl:CRYSTAL: Various standard crystals. Proven footprints.
R1-R4 R101 R102 R201 R204 R301-R308 = resistor:R-EU_: RESISTOR, European symbol
R501 R502 R504 R505 = rcl:R-EU_: RESISTOR, European symbol
SJ101 SJ102 SJ201-SJ204 = jumper:SJ: SMD solder JUMPER
SJ301 = jumper:SJ2W: SMD solder JUMPER
T1 T2 T201 T301 T302 = SparkFun-DiscreteSemi:TRANSISTOR_NPN: Generic NPN BJT MMBT2222A - TRANS-08049 (SOT-23, 1A 40V) MPSA42 - TRANS-09116 (SOT-23, 500mA 300V) MMBT5088LT1G - TRANS-11160 (SOT-23, 50 mA 30V)
U1 = SparkFun-Boards:GY-80-MIN: GY-80 IMU 10DOF HMC5883 3-axis magnet field sensor ADXL345 3-axis accelerometer sensor L3G4200D 3-axis gyroscope sensor BMP085 atmospheric pressure sensor
U201 U202 = SparkFun-Boards:MP1584
U203 U204 = scorpion:MOD_LM2596
U301 = scorpion:MOD_MCP2515
U$1 = SparkFun:KURRO_FOOTPRINT

## Net classes
0 default: width 0.406 mm, drill 0.59 mm, clearance 0.254 mm
1 ic: width 0.254 mm, drill 0.59 mm, clearance 0.203 mm
2 power: width 0.61 mm, drill 0.79 mm, clearance 0.305 mm